# Altium schematic sheet EVK-IRIS-W1_MOD.SchDoc
size A3; DocumentNumber: 2; SheetNumber: 2; SheetTotal: 14
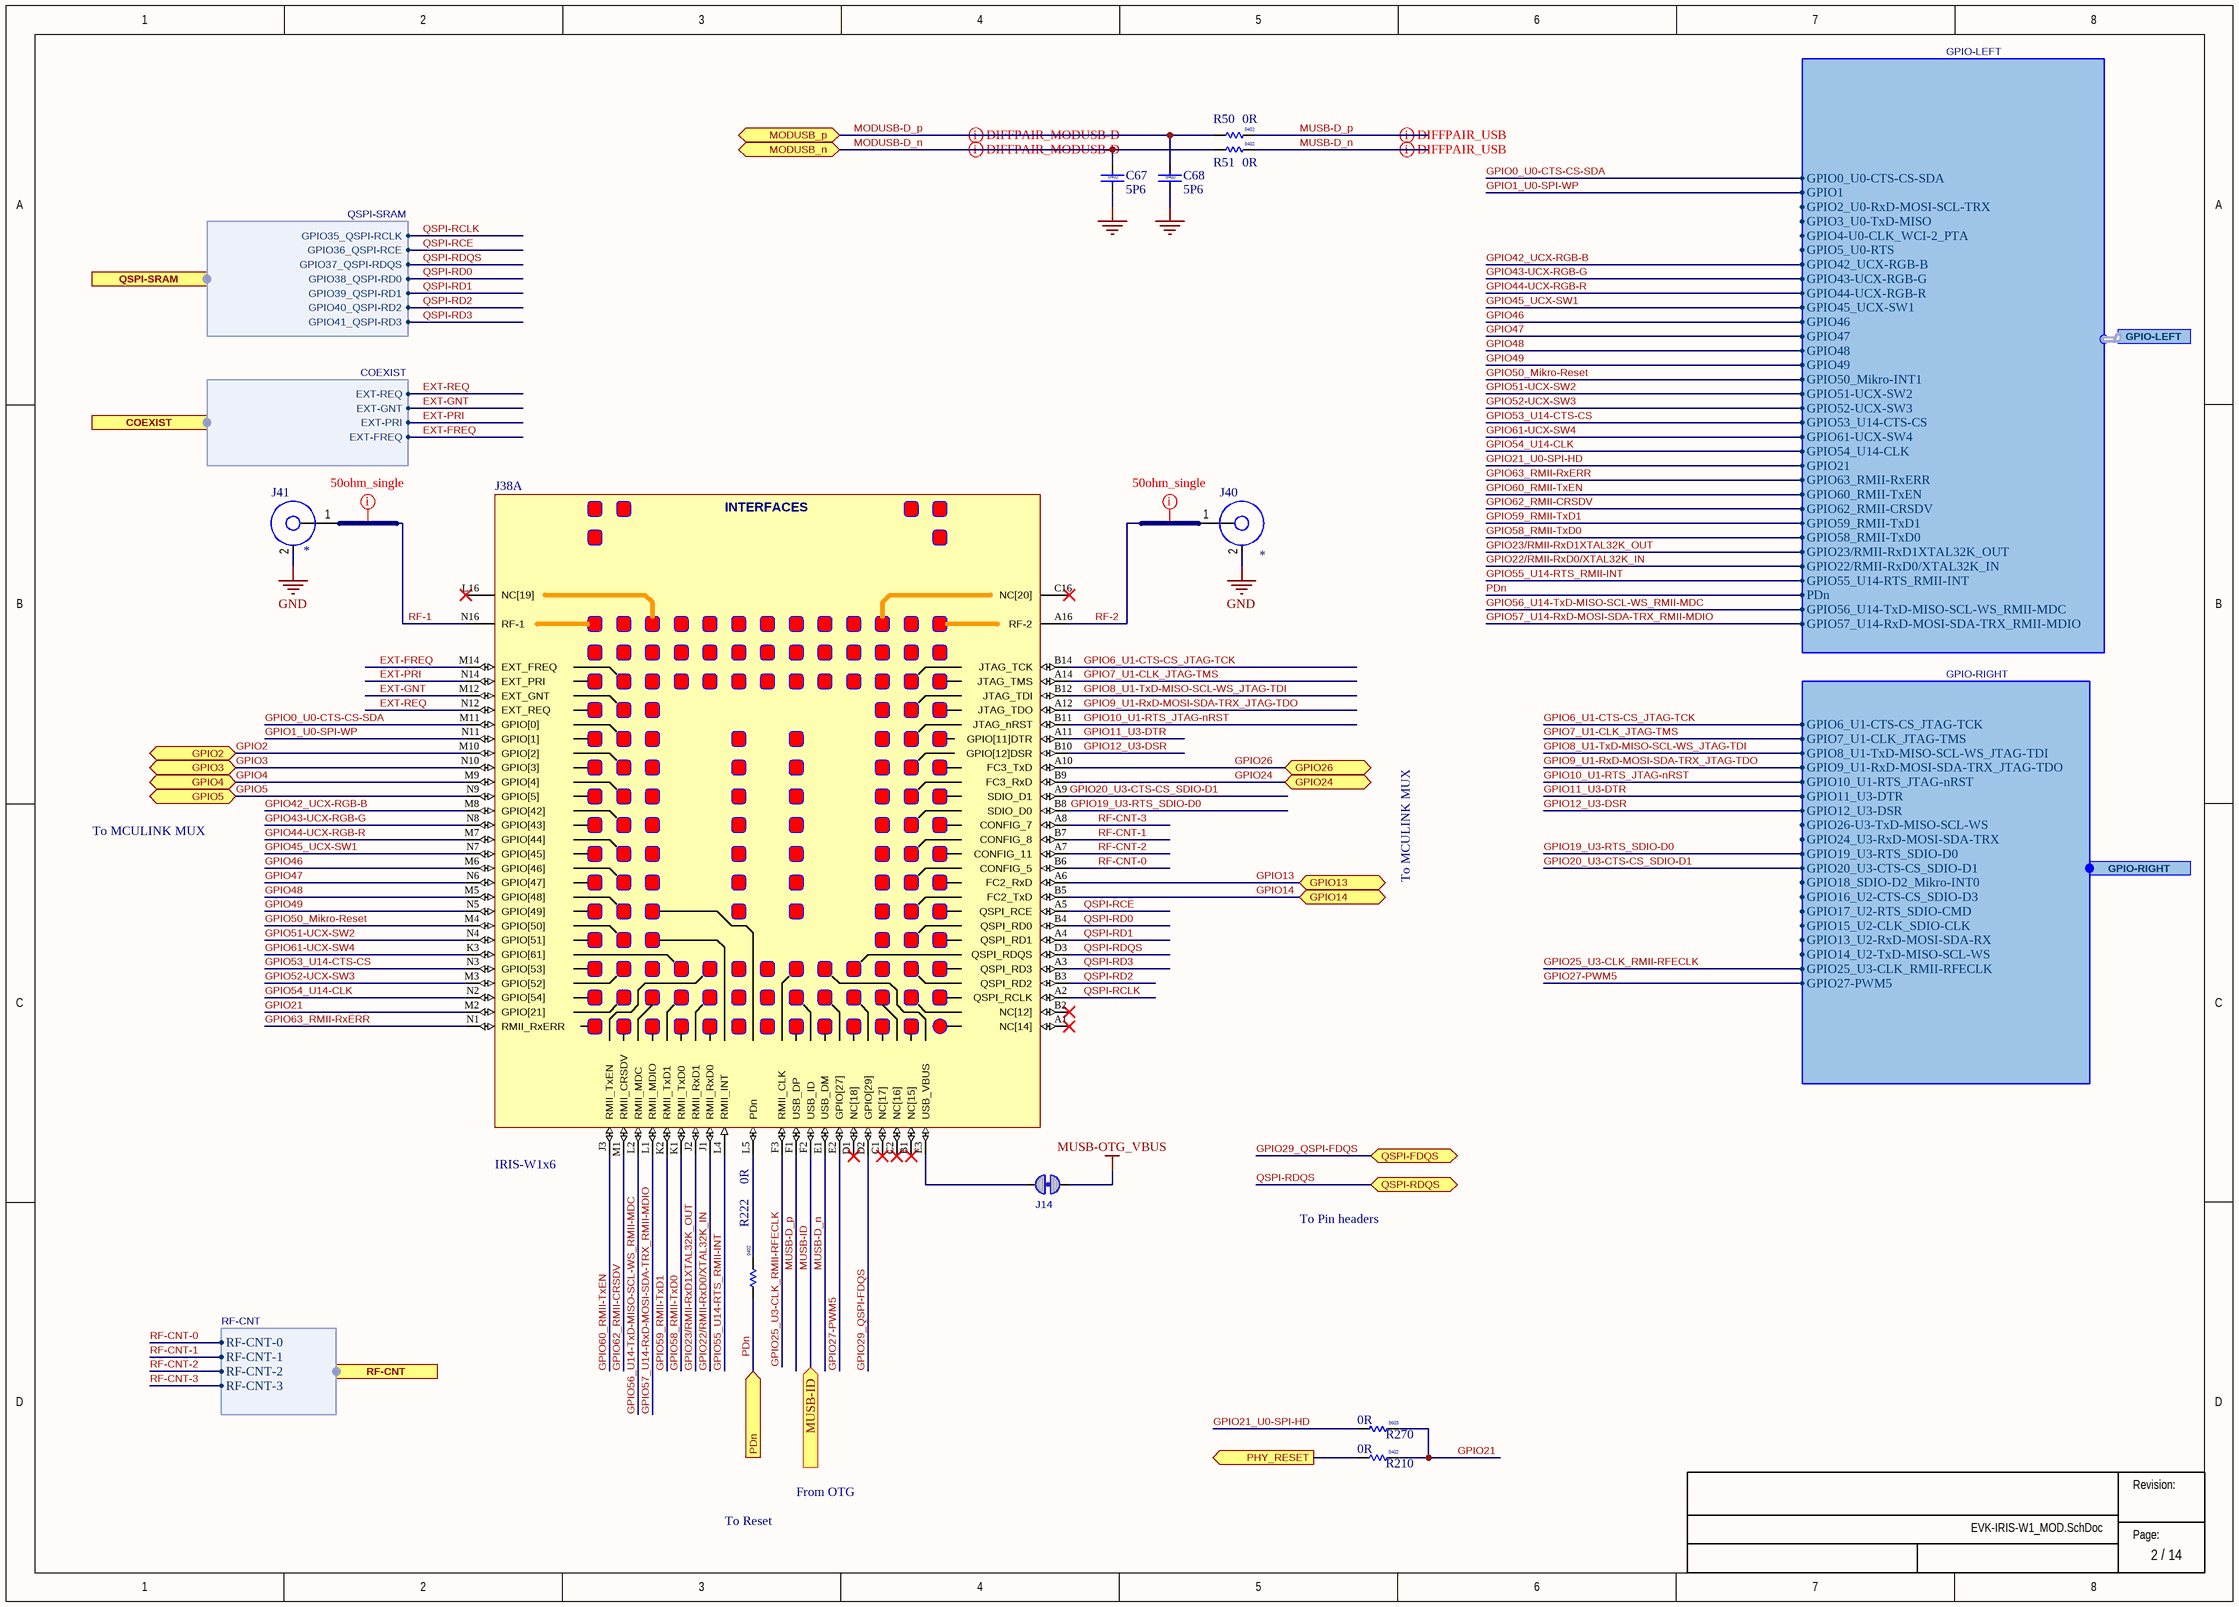
[diagram p0: EVK-IRIS-W1_MOD.SchDoc]

## Parts
C67  value 5P6  Size: 0402  [Cap 0402]
C68  value 5P6  Size: 0402  [Cap 0402]
J14  Solderbridge-ShortDNP  [Solderbridge-Short]  (value not drawn)  (net tie, no BOM)
J38  IRIS-W1x6  [IRIS-W1x6_LGA152]  (part A of 2)
J40  (no value)  [U.FL_3Pin]
J41  (no value)  [U.FL_3Pin]
R50  value 0R  Size: 0402  [RES 0402 HD]
R51  value 0R  Size: 0402  [RES 0402 HD]
R210  value 0R  Size: 0402  [RES 0402 HD]
R222  value 0R  Size: 0402  [RES 0402 HD]
R270  value 0R  Size: 0603  [RES 0603 HD]

## Ports
COEXIST (harness COEXIST), GPIO2 (bidir), GPIO3 (bidir), GPIO4 (bidir), GPIO5 (bidir), GPIO13 (bidir), GPIO14 (bidir), GPIO24 (bidir), GPIO26 (bidir), GPIO-LEFT (harness GPIO-LEFT), GPIO-RIGHT (harness GPIO-RIGHT), MODUSB_n (bidir), MODUSB_p (bidir), MUSB-ID (in), PDn (in), PHY_RESET (out), QSPI-FDQS (bidir), QSPI-RDQS (bidir), QSPI-SRAM (harness QSPI-SRAM), RF-CNT (harness RF-CNT)

## Harnesses
QSPI-SRAM: GPIO35_QSPI-RCLK, GPIO36_QSPI-RCE, GPIO37_QSPI-RDQS, GPIO38_QSPI-RD0, GPIO39_QSPI-RD1, GPIO40_QSPI-RD2, GPIO41_QSPI-RD3
COEXIST: EXT-REQ, EXT-GNT, EXT-PRI, EXT-FREQ
GPIO-RIGHT: GPIO6_U1-CTS-CS_JTAG-TCK, GPIO7_U1-CLK_JTAG-TMS, GPIO8_U1-TxD-MISO-SCL-WS_JTAG-TDI, GPIO9_U1-RxD-MOSI-SDA-TRX_JTAG-TDO, GPIO10_U1-RTS_JTAG-nRST, GPIO11_U3-DTR, GPIO12_U3-DSR, GPIO26-U3-TxD-MISO-SCL-WS, GPIO24_U3-RxD-MOSI-SDA-TRX, GPIO19_U3-RTS_SDIO-D0, GPIO20_U3-CTS-CS_SDIO-D1, GPIO18_SDIO-D2_Mikro-INT0, GPIO16_U2-CTS-CS_SDIO-D3, GPIO17_U2-RTS_SDIO-CMD, GPIO15_U2-CLK_SDIO-CLK, GPIO13_U2-RxD-MOSI-SDA-RX, GPIO14_U2-TxD-MISO-SCL-WS, GPIO25_U3-CLK_RMII-RFECLK, GPIO27-PWM5
GPIO-LEFT: GPIO0_U0-CTS-CS-SDA, GPIO1, GPIO2_U0-RxD-MOSI-SCL-TRX, GPIO3_U0-TxD-MISO, GPIO4-U0-CLK_WCI-2_PTA, GPIO5_U0-RTS, GPIO42_UCX-RGB-B, GPIO43-UCX-RGB-G, GPIO44-UCX-RGB-R, GPIO45_UCX-SW1, GPIO46, GPIO47, GPIO48, GPIO49, GPIO50_Mikro-INT1, GPIO51-UCX-SW2, GPIO52-UCX-SW3, GPIO53_U14-CTS-CS, GPIO61-UCX-SW4, GPIO54_U14-CLK, GPIO21, GPIO63_RMII-RxERR, GPIO60_RMII-TxEN, GPIO62_RMII-CRSDV, GPIO59_RMII-TxD1, GPIO58_RMII-TxD0, GPIO23/RMII-RxD1XTAL32K_OUT, GPIO22/RMII-RxD0/XTAL32K_IN, GPIO55_U14-RTS_RMII-INT, PDn, GPIO56_U14-TxD-MISO-SCL-WS_RMII-MDC, GPIO57_U14-RxD-MOSI-SDA-TRX_RMII-MDIO
RF-CNT: RF-CNT-0, RF-CNT-1, RF-CNT-2, RF-CNT-3

## Nets
GND: C67.2 C68.2 J40.2 J41.2
MUSB-OTG_VBUS: J14.2
EXT-FREQ: J38.M14(EXT_FREQ) ; port COEXIST.EXT-FREQ
EXT-GNT: J38.M12(EXT_GNT) ; port COEXIST.EXT-GNT
EXT-PRI: J38.N14(EXT_PRI) ; port COEXIST.EXT-PRI
EXT-REQ: J38.N12(EXT_REQ) ; port COEXIST.EXT-REQ
GPIO0_U0-CTS-CS-SDA: J38.M11(GPIO[0]) ; port GPIO-LEFT.GPIO0_U0-CTS-CS-SDA
GPIO1_U0-SPI-WP: J38.N11(GPIO[1]) ; port GPIO-LEFT.GPIO1
GPIO2: J38.M10(GPIO[2]) ; port GPIO2
GPIO3: J38.N10(GPIO[3]) ; port GPIO3
GPIO4: J38.M9(GPIO[4]) ; port GPIO4
GPIO5: J38.N9(GPIO[5]) ; port GPIO5
GPIO6_U1-CTS-CS_JTAG-TCK: J38.B14(JTAG_TCK) ; port GPIO-RIGHT.GPIO6_U1-CTS-CS_JTAG-TCK
GPIO7_U1-CLK_JTAG-TMS: J38.A14(JTAG_TMS) ; port GPIO-RIGHT.GPIO7_U1-CLK_JTAG-TMS
GPIO8_U1-TxD-MISO-SCL-WS_JTAG-TDI: J38.B12(JTAG_TDI) ; port GPIO-RIGHT.GPIO8_U1-TxD-MISO-SCL-WS_JTAG-TDI
GPIO9_U1-RxD-MOSI-SDA-TRX_JTAG-TDO: J38.A12(JTAG_TDO) ; port GPIO-RIGHT.GPIO9_U1-RxD-MOSI-SDA-TRX_JTAG-TDO
GPIO10_U1-RTS_JTAG-nRST: J38.B11(JTAG_nRST) ; port GPIO-RIGHT.GPIO10_U1-RTS_JTAG-nRST
GPIO11_U3-DTR: J38.A11(GPIO[11]DTR) ; port GPIO-RIGHT.GPIO11_U3-DTR
GPIO12_U3-DSR: J38.B10(GPIO[12]DSR) ; port GPIO-RIGHT.GPIO12_U3-DSR
GPIO13: J38.A6(FC2_RxD) ; port GPIO13
GPIO14: J38.B5(FC2_TxD) ; port GPIO14
GPIO19_U3-RTS_SDIO-D0: J38.B8(SDIO_D0) ; port GPIO-RIGHT.GPIO19_U3-RTS_SDIO-D0
GPIO20_U3-CTS-CS_SDIO-D1: J38.A9(SDIO_D1) ; port GPIO-RIGHT.GPIO20_U3-CTS-CS_SDIO-D1
GPIO21: J38.M2(GPIO[21]) R210.2 R270.2
GPIO21_U0-SPI-HD: R270.1 ; port GPIO-LEFT.GPIO21
GPIO22/RMII-RxD0/XTAL32K_IN: J38.J1(RMII_RxD0) ; port GPIO-LEFT.GPIO22/RMII-RxD0/XTAL32K_IN
GPIO23/RMII-RxD1XTAL32K_OUT: J38.J2(RMII_RxD1) ; port GPIO-LEFT.GPIO23/RMII-RxD1XTAL32K_OUT
GPIO24: J38.B9(FC3_RxD) ; port GPIO24
GPIO25_U3-CLK_RMII-RFECLK: J38.F3(RMII_CLK) ; port GPIO-RIGHT.GPIO25_U3-CLK_RMII-RFECLK
GPIO26: J38.A10(FC3_TxD) ; port GPIO26
GPIO27-PWM5: J38.E2(GPIO[27]) ; port GPIO-RIGHT.GPIO27-PWM5
GPIO29_QSPI-FDQS: J38.D2(GPIO[29]) ; port QSPI-FDQS
GPIO42_UCX-RGB-B: J38.M8(GPIO[42]) ; port GPIO-LEFT.GPIO42_UCX-RGB-B
GPIO43-UCX-RGB-G: J38.N8(GPIO[43]) ; port GPIO-LEFT.GPIO43-UCX-RGB-G
GPIO44-UCX-RGB-R: J38.M7(GPIO[44]) ; port GPIO-LEFT.GPIO44-UCX-RGB-R
GPIO45_UCX-SW1: J38.N7(GPIO[45]) ; port GPIO-LEFT.GPIO45_UCX-SW1
GPIO46: J38.M6(GPIO[46]) ; port GPIO-LEFT.GPIO46
GPIO47: J38.N6(GPIO[47]) ; port GPIO-LEFT.GPIO47
GPIO48: J38.M5(GPIO[48]) ; port GPIO-LEFT.GPIO48
GPIO49: J38.N5(GPIO[49]) ; port GPIO-LEFT.GPIO49
GPIO50_Mikro-Reset: J38.M4(GPIO[50]) ; port GPIO-LEFT.GPIO50_Mikro-INT1
GPIO51-UCX-SW2: J38.N4(GPIO[51]) ; port GPIO-LEFT.GPIO51-UCX-SW2
GPIO52-UCX-SW3: J38.M3(GPIO[52]) ; port GPIO-LEFT.GPIO52-UCX-SW3
GPIO53_U14-CTS-CS: J38.N3(GPIO[53]) ; port GPIO-LEFT.GPIO53_U14-CTS-CS
GPIO54_U14-CLK: J38.N2(GPIO[54]) ; port GPIO-LEFT.GPIO54_U14-CLK
GPIO55_U14-RTS_RMII-INT: J38.L4(RMII_INT) ; port GPIO-LEFT.GPIO55_U14-RTS_RMII-INT
GPIO56_U14-TxD-MISO-SCL-WS_RMII-MDC: J38.L2(RMII_MDC) ; port GPIO-LEFT.GPIO56_U14-TxD-MISO-SCL-WS_RMII-MDC
GPIO57_U14-RxD-MOSI-SDA-TRX_RMII-MDIO: J38.L1(RMII_MDIO) ; port GPIO-LEFT.GPIO57_U14-RxD-MOSI-SDA-TRX_RMII-MDIO
GPIO58_RMII-TxD0: J38.K1(RMII_TxD0) ; port GPIO-LEFT.GPIO58_RMII-TxD0
GPIO59_RMII-TxD1: J38.K2(RMII_TxD1) ; port GPIO-LEFT.GPIO59_RMII-TxD1
GPIO60_RMII-TxEN: J38.J3(RMII_TxEN) ; port GPIO-LEFT.GPIO60_RMII-TxEN
GPIO61-UCX-SW4: J38.K3(GPIO[61]) ; port GPIO-LEFT.GPIO61-UCX-SW4
GPIO62_RMII-CRSDV: J38.M1(RMII_CRSDV) ; port GPIO-LEFT.GPIO62_RMII-CRSDV
GPIO63_RMII-RxERR: J38.N1(RMII_RxERR) ; port GPIO-LEFT.GPIO63_RMII-RxERR
MODUSB-D_n: C67.1 R51.1 ; port MODUSB_n
MODUSB-D_p: C68.1 R50.1 ; port MODUSB_p
MUSB-D_n: J38.E1(USB_DM) R51.2
MUSB-D_p: J38.F1(USB_DP) R50.2
MUSB-ID: J38.F2(USB_ID) ; port MUSB-ID
PDn: R222.1 ; port PDn, port GPIO-LEFT.PDn
PHY_RESET: R210.1 ; port PHY_RESET
QSPI-RCE: J38.A5(QSPI_RCE) ; port QSPI-SRAM.GPIO36_QSPI-RCE
QSPI-RCLK: J38.A2(QSPI_RCLK) ; port QSPI-SRAM.GPIO35_QSPI-RCLK
QSPI-RD0: J38.B4(QSPI_RD0) ; port QSPI-SRAM.GPIO38_QSPI-RD0
QSPI-RD1: J38.A4(QSPI_RD1) ; port QSPI-SRAM.GPIO39_QSPI-RD1
QSPI-RD2: J38.B3(QSPI_RD2) ; port QSPI-SRAM.GPIO40_QSPI-RD2
QSPI-RD3: J38.A3(QSPI_RD3) ; port QSPI-SRAM.GPIO41_QSPI-RD3
QSPI-RDQS: J38.D3(QSPI_RDQS) ; port QSPI-RDQS, port QSPI-SRAM.GPIO37_QSPI-RDQS
RF-1: J38.N16(RF-1) J41.1(ANT)
RF-2: J38.A16(RF-2) J40.1(ANT)
RF-CNT-0: J38.B6(CONFIG_5) ; port RF-CNT.RF-CNT-0
RF-CNT-1: J38.B7(CONFIG_8) ; port RF-CNT.RF-CNT-1
RF-CNT-2: J38.A7(CONFIG_11) ; port RF-CNT.RF-CNT-2
RF-CNT-3: J38.A8(CONFIG_7) ; port RF-CNT.RF-CNT-3
NetJ14_1: J14.1 J38.E3(USB_VBUS)
NetJ38_L5: J38.L5(PDn) R222.2

Not connected (* = marked no-connect by the designer): J38 A1(NC[14])* B1(NC[15])* B2(NC[12])* C1(NC[17])* C2(NC[16])* C16(NC[20])* D1(NC[18])* L16(NC[19])*

## Layout directives
differential pair; differential pair class USB_DIFF; net class USB_DIFF: MODUSB-D_n, MODUSB-D_p, MUSB-D_n, MUSB-D_p
net class 50_ohm_se: RF-1, RF-2

## Notes on the sheet
- To MCULINK MUX
- To Pin headers
- To Reset
- From OTG
- Revision:
- Page:
- (in symbol UBXH14-0000681, part A) INTERFACES

## Library data of the parts
C67 C68 = UBXH01-0004011: CAP CER C0G 0402 5P6 +/-0.25P 25V; Manufacturer: Murata Manufacturing Company, Ltd.; Manufacturer P/N: GRM1555C1H5R6CZ01; Editor: roland.rust; Env: ROHS; Permitted Use: Volume Products; Perferred: PREF; Mfg P/N Status: Obsolete; Mfg P/N Split: 0; Part Number: UBXH01-0004011; Tolerance: +/-0.25P; Max Voltage: 25V; Part Type: Capacitor; Released by: roland.rust; Release Data: 2007-10-22T12:46:36; UBX Wiki: https://wiki.u-blox.com/bin/view/Operations/PartDetails?index=5160; RefDes: C; Mfg P/N Released: Obsolete; Manufacturer 2: Murata Manufacturing Company, Ltd.; Manufacturer P/N 2: GRM1555C1E5R6CZ01; Mfg P/N Status 2: Obsolete; Mfg P/N Split 2: 0; Mfg P/N Released 2: Obsolete
J14 = Solderbridge-Short: Added By: Paul B; Part Number: Solderbridge-Short; Height: 0; DNP: DNP; Added Date: 12/2/2015
J38 = UBXH14-0000681: SHORT RANGE STAND-ALONE MULTIRADIO MODULE U-BLOX IRIS-W106; Editor: olof.viklund; Env: ROHS; Permitted Use: Volume Products; Perferred: PREF; Part Number: UBXH14-0000681; Min Operating Temp: -40°C; Max Operating Temp: 85°C; Part Type: RF; UBX Wiki: https://wiki.u-blox.com/bin/view/Operations/PartDetails?index=38240; RefDes: A
J40 J41 = 130-00067: U.FL jack, SMA 50 ohm, 3 pin, SMT; Part Name: CON RF UMC U.FL Jack 3Pin SMT; Manufacturer 1: Hirose Electric Co Ltd; Manufacturer Part Number 1: U.FL-R-SMT(10); Use in new designs: Yes; UBX Code: UBXH04-0001026; Voltage: None; Item Phase: In Production; Manufacturer P/N: *; Part Number: 130-00067; Revision: 0A; Supplier 1: Digi-Key; Supplier Part Number 1: H9161CT-ND; Manufacturer 2: Dongguan Qintai Electronics Co, Ltd.; Supplier 2: Rayson Technology co., ltd; Supplier Part Number 2: MHF-RT-1; Height: 1.25mm; Pins: 3; Max Operating Temp: 90; Diameter: None; Min Operating Temp: -40; Manufacturer Part Number 2: MHF-RT-1
R50 R51 R210 R222 = UBXH18-0003002: RES THICK FILM CHIP 0402 0R 0 100mW; Manufacturer: KOA; Manufacturer P/N: RK73Z1ETTD; Tolerance: 0; Editor: charlotte.biber; Released by: peter.mueller; Env: ROHS; Permitted Use: Volume Products; Perferred: PREF; Mfg P/N Status: NRND; Mfg P/N Split: 100; Mfg P/N Released: Yes; Part Number: UBXH18-0003002; Max Power: 100mW; Part Type: Resistor; Release Data: 2012-06-05T09:49:55; UBX Wiki: https://wiki.u-blox.com/bin/view/Operations/PartDetails?index=6611; RefDes: R; Manufacturer 2: YAGEO; Manufacturer P/N 2: 2322_705_91001_L; Mfg P/N Status 2: NRND; Mfg P/N Split 2: 0; Mfg P/N Released 2: Yes
R270 = UBXH18-0003001: RES THICK FILM CHIP 0603 0R 0 100mW; Manufacturer: YAGEO; Manufacturer P/N: RC0603JR-070RL; Tolerance: 0; Editor: martin.frauchiger; Env: ROHS; Permitted Use: Volume Products; Perferred: PREF; Mfg P/N Status: Active; Mfg P/N Split: 100; Mfg P/N Released: Yes; Part Number: UBXH18-0003001; Max Power: 100mW; Part Type: Resistor; Released by: martin.frauchiger; Release Data: 2005-07-14T10:55:51; UBX Wiki: https://wiki.u-blox.com/bin/view/Operations/PartDetails?index=6609; RefDes: R